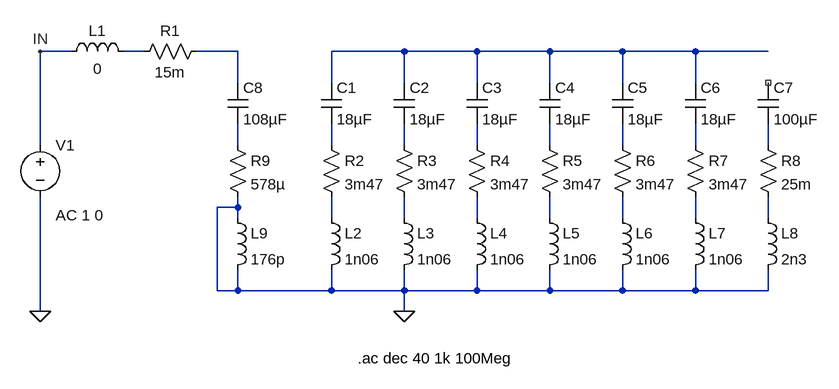
[diagram p0: schematic output_filter_transfer.asc]
output_filter_transfer.asc, the LTspice schematic file:
Version 4
SHEET 1 1220 680
WIRE 64 128 16 128
WIRE 176 128 144 128
WIRE 320 128 256 128
WIRE 576 128 464 128
WIRE 688 128 576 128
WIRE 800 128 688 128
WIRE 912 128 800 128
WIRE 1024 128 912 128
WIRE 1136 128 1024 128
WIRE 320 176 320 128
WIRE 464 176 464 128
WIRE 576 176 576 128
WIRE 688 176 688 128
WIRE 800 176 800 128
WIRE 912 176 912 128
WIRE 1024 176 1024 128
WIRE 16 272 16 128
WIRE 320 272 320 240
WIRE 464 272 464 240
WIRE 576 272 576 240
WIRE 688 272 688 240
WIRE 800 272 800 240
WIRE 912 272 912 240
WIRE 1024 272 1024 240
WIRE 1136 272 1136 240
WIRE 320 368 320 352
WIRE 320 368 288 368
WIRE 320 384 320 368
WIRE 464 384 464 352
WIRE 576 384 576 352
WIRE 688 384 688 352
WIRE 800 384 800 352
WIRE 912 384 912 352
WIRE 1024 384 1024 352
WIRE 1136 384 1136 352
WIRE 288 496 288 368
WIRE 320 496 320 464
WIRE 320 496 288 496
WIRE 464 496 464 464
WIRE 464 496 320 496
WIRE 576 496 576 464
WIRE 576 496 464 496
WIRE 688 496 688 464
WIRE 688 496 576 496
WIRE 800 496 800 464
WIRE 800 496 688 496
WIRE 912 496 912 464
WIRE 912 496 800 496
WIRE 1024 496 1024 464
WIRE 1024 496 912 496
WIRE 1136 496 1136 464
WIRE 1136 496 1024 496
WIRE 16 528 16 352
WIRE 576 528 576 496
FLAG 576 528 0
FLAG 16 128 IN
FLAG 16 528 0
SYMBOL res 272 112 R90
WINDOW 0 0 56 VBottom 2
WINDOW 3 32 56 VTop 2
SYMATTR InstName R1
SYMATTR Value 15m
SYMBOL cap 448 176 R0
SYMATTR InstName C1
SYMATTR Value 18µF
SYMBOL res 448 256 R0
SYMATTR InstName R2
SYMATTR Value 3m47
SYMBOL ind 448 368 R0
SYMATTR InstName L2
SYMATTR Value 1n06
SYMBOL voltage 16 256 R0
WINDOW 123 24 124 Left 2
WINDOW 39 0 0 Left 0
SYMATTR Value2 AC 1 0
SYMATTR InstName V1
SYMATTR Value ""
SYMBOL ind 48 144 R270
WINDOW 0 32 56 VTop 2
WINDOW 3 5 56 VBottom 2
SYMATTR InstName L1
SYMATTR Value 0
SYMBOL cap 560 176 R0
SYMATTR InstName C2
SYMATTR Value 18µF
SYMBOL res 560 256 R0
SYMATTR InstName R3
SYMATTR Value 3m47
SYMBOL ind 560 368 R0
SYMATTR InstName L3
SYMATTR Value 1n06
SYMBOL cap 672 176 R0
SYMATTR InstName C3
SYMATTR Value 18µF
SYMBOL res 672 256 R0
SYMATTR InstName R4
SYMATTR Value 3m47
SYMBOL ind 672 368 R0
SYMATTR InstName L4
SYMATTR Value 1n06
SYMBOL cap 784 176 R0
SYMATTR InstName C4
SYMATTR Value 18µF
SYMBOL res 784 256 R0
SYMATTR InstName R5
SYMATTR Value 3m47
SYMBOL ind 784 368 R0
SYMATTR InstName L5
SYMATTR Value 1n06
SYMBOL cap 896 176 R0
SYMATTR InstName C5
SYMATTR Value 18µF
SYMBOL res 896 256 R0
SYMATTR InstName R6
SYMATTR Value 3m47
SYMBOL ind 896 368 R0
SYMATTR InstName L6
SYMATTR Value 1n06
SYMBOL cap 1008 176 R0
SYMATTR InstName C6
SYMATTR Value 18µF
SYMBOL res 1008 256 R0
SYMATTR InstName R7
SYMATTR Value 3m47
SYMBOL ind 1008 368 R0
SYMATTR InstName L7
SYMATTR Value 1n06
SYMBOL cap 1120 176 R0
SYMATTR InstName C7
SYMATTR Value 100µF
SYMBOL res 1120 256 R0
SYMATTR InstName R8
SYMATTR Value 25m
SYMBOL ind 1120 368 R0
SYMATTR InstName L8
SYMATTR Value 2n3
SYMBOL cap 304 176 R0
SYMATTR InstName C8
SYMATTR Value 108µF
SYMBOL res 304 256 R0
SYMATTR InstName R9
SYMATTR Value 578µ
SYMBOL ind 304 368 R0
SYMATTR InstName L9
SYMATTR Value 176p
TEXT 504 600 Left 2 !.ac dec 40 1k 100Meg

The netlist it stands for:
* output_filter_transfer.asc
R1 N002 N001 15m
C1 N003 N005 18µF
R2 N005 N012 3m47
L2 N012 0 1n06
V1 IN 0 AC 1 0
L1 IN N001 0
C2 N003 N006 18µF
R3 N006 N013 3m47
L3 N013 0 1n06
C3 N003 N007 18µF
R4 N007 N014 3m47
L4 N014 0 1n06
C4 N003 N008 18µF
R5 N008 N015 3m47
L5 N015 0 1n06
C5 N003 N009 18µF
R6 N009 N016 3m47
L6 N016 0 1n06
C6 N003 N010 18µF
R7 N010 N017 3m47
L7 N017 0 1n06
C7 NC_01 N011 100µF
R8 N011 N018 25m
L8 N018 0 2n3
C8 N002 N004 108µF
R9 N004 0 578µ
L9 0 0 176p
.ac dec 40 1k 100Meg
.backanno
.end